# EAGLE design e202var-receiver-v1 (EAGLE 6.6.0)
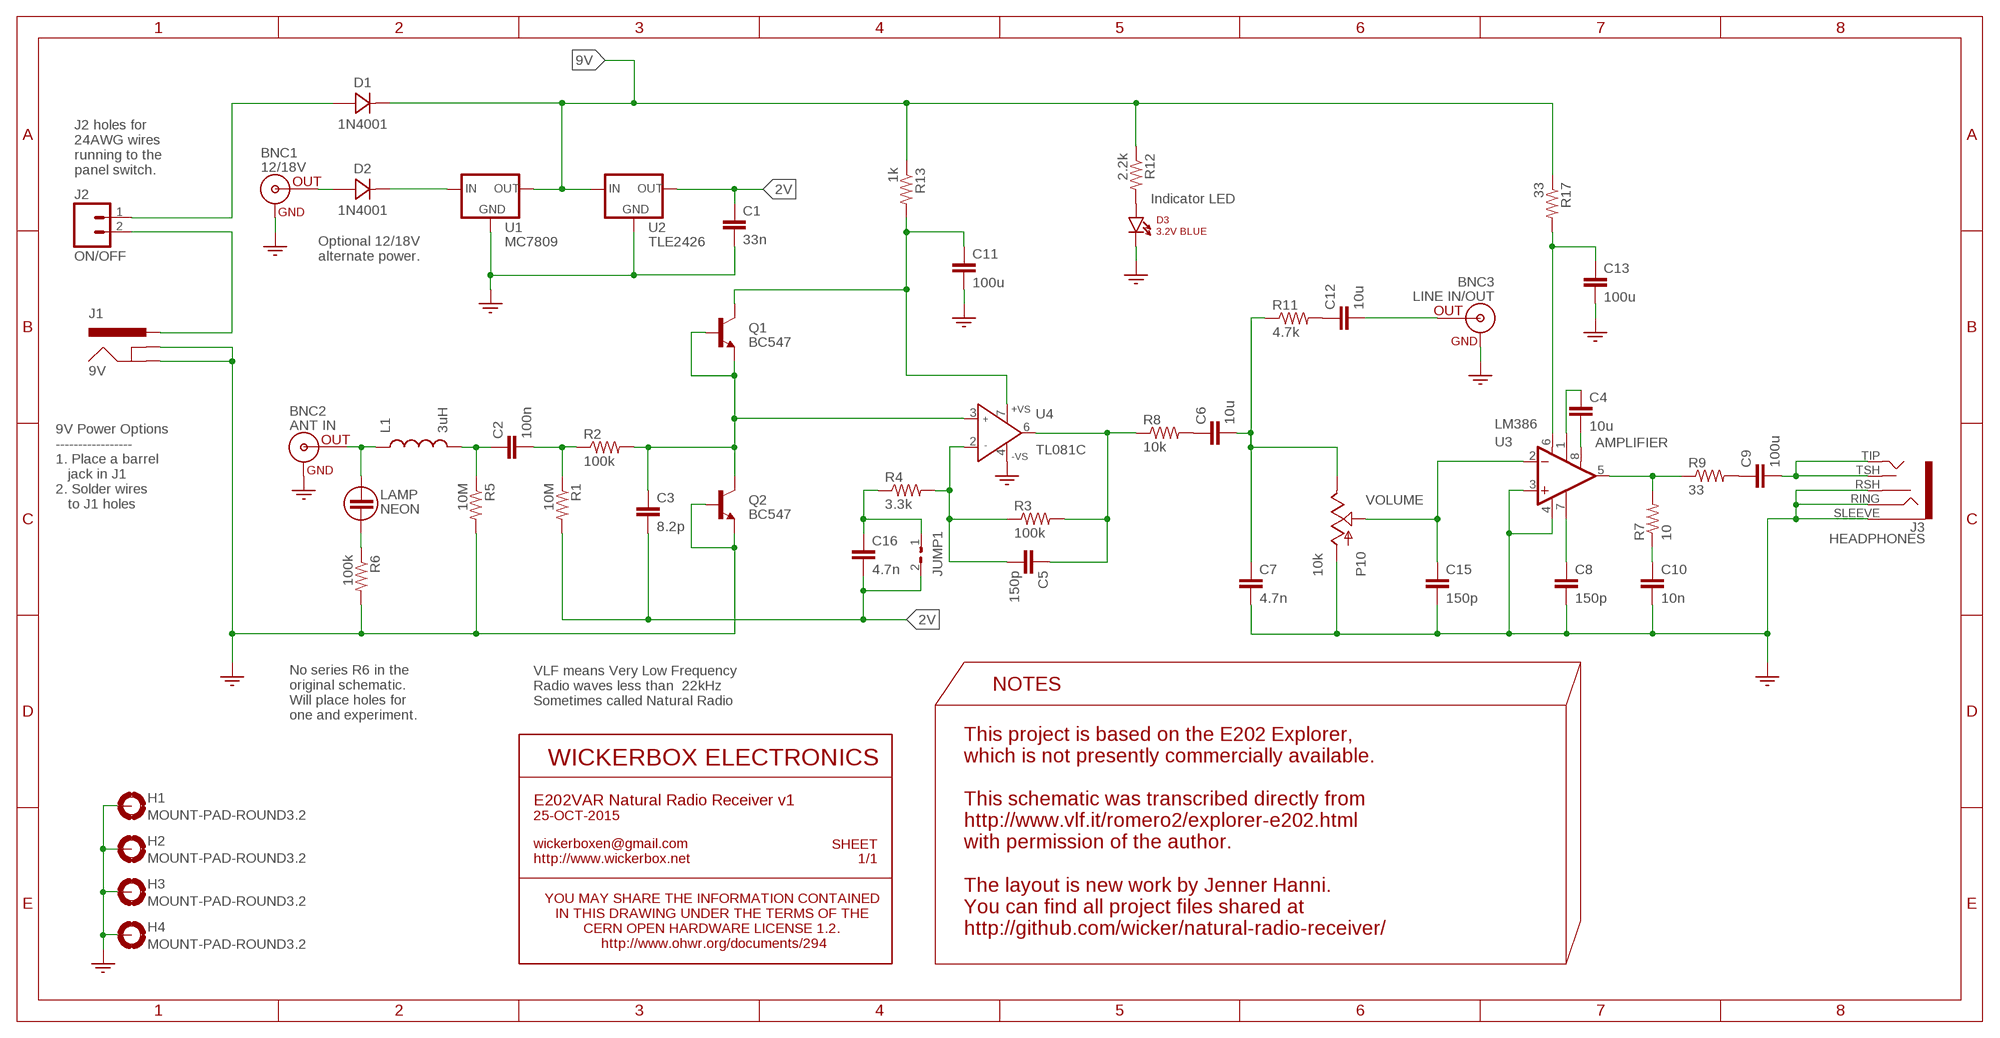
[diagram p0: schematic, sheet 1]

## Parts
BNC1  12/18V  BNC-MOLEX-SD-73100  [BNC-MOLEX-SD-73100]
BNC2  ANT IN  BNC-MOLEX-SD-73100  [BNC-MOLEX-SD-73100]
BNC3  LINE IN/OUT  BNC-MOLEX-SD-73100  [BNC-MOLEX-SD-73100]
C1  33n  CAPACITOR5MM  [CAP-RADIAL-5MM-NONPOL]
C2  100n  CAPACITOR5MM  [CAP-RADIAL-5MM-NONPOL]
C3  8.2p  CAPACITOR5MM  [CAP-RADIAL-5MM-NONPOL]
C4  10u  CAPACITOR2.5MM  [CAP-RADIAL-2.5MM-NONPOL]
C5  150p  CAPACITOR2.5MM  [CAP-RADIAL-2.5MM-NONPOL]
C6  10u  CAPACITOR2.5MM  [CAP-RADIAL-2.5MM-NONPOL]
C7  4.7n  CAPACITOR5MM  [CAP-RADIAL-5MM-NONPOL]
C8  150p  CAPACITOR2.5MM  [CAP-RADIAL-2.5MM-NONPOL]
C9  100u  CAPACITOR5MM  [CAP-RADIAL-5MM-NONPOL]
C10  10n  CAPACITOR2.5MM  [CAP-RADIAL-2.5MM-NONPOL]
C11  100u  CAPACITOR5MM  [CAP-RADIAL-5MM-NONPOL]
C12  10u  CAPACITOR2.5MM  [CAP-RADIAL-2.5MM-NONPOL]
C13  100u  CAPACITOR5MM  [CAP-RADIAL-5MM-NONPOL]
C15  150p  CAPACITOR2.5MM  [CAP-RADIAL-2.5MM-NONPOL]
C16  4.7n  CAPACITOR5MM  [CAP-RADIAL-5MM-NONPOL]
D1  1N4001  DIODE  [DIODE-DO41]
D2  1N4001  DIODE  [DIODE-DO41]
D3  3.2V BLUE  LED  [LED-2PIN-0.1IN]
H1  MOUNT-PAD-ROUND3.2  [3,2-PAD]
H2  MOUNT-PAD-ROUND3.2  [3,2-PAD]
H3  MOUNT-PAD-ROUND3.2  [3,2-PAD]
H4  MOUNT-PAD-ROUND3.2  [3,2-PAD]
J1  9V  JACK-POWER-BARREL  [JACK-POWER]
J2  ON/OFF  CONN-2PIN  [CONN-2PIN-0.1IN]
J3  HEADPHONES  JACK-AUDIO  [JACK-AUDIO-5PIN]
JUMP1  HPF  JUMPER-SHUNT  [CONN-2PIN-0.1IN]
L1  3uH  INDUCTOR  [RES-CF14-TH]
LAMP  NEON  LAMP-NEON  [LAMP-2PIN-0.1IN]
P10  10k  POT-P160KN-0QC15B10K  [POT-3PIN-LINEAR]
Q1  BC547  BJT-NPN  [TO-92-AMMO]
Q2  BC547  BJT-NPN  [TO-92-AMMO]
R1  10M  RESISTOR  [RES-CF14-TH]
R2  100k  RESISTOR  [RES-CF14-TH]
R3  100k  RESISTOR  [RES-CF14-TH]
R4  3.3k  RESISTOR  [RES-CF14-TH]
R5  10M  RESISTOR  [RES-CF14-TH]
R6  100k  RESISTOR  [RES-CF14-TH]
R7  10  RESISTOR  [RES-CF14-TH]
R8  10k  RESISTOR  [RES-CF14-TH]
R9  33  RESISTOR  [RES-CF14-TH]
R11  4.7k  RESISTOR  [RES-CF14-TH]
R12  2.2k  RESISTOR  [RES-CF14-TH]
R13  1k  RESISTOR  [RES-CF14-TH]
R17  33  RESISTOR  [RES-CF14-TH]
U1  MC7809  VOLTREG-MC7809  [TO-220]
U2  TLE2426  VOLTREG-TLE2426  [DIP-08]
U3  LM386  AMP-AUDIO-LM386  [DIP-08]
U4  TL081C  AMP-JFET-TL081CP  [DIP-08]

## Nets
2V: C1.1 C3.2 C16.2 JUMP1.2 R1.P$2 U2.1(OUT)
9V: D1.C(CATHODE) R12.P$1 R13.P$1 R17.P$1 U1.OUT U2.3(IN)
9V1: J1.PWR J2.2
9V2: D1.A(ANODE) J2.1
GND: BNC1.GND BNC1.GND1(GND) BNC2.GND BNC2.GND1(GND) BNC3.GND BNC3.GND1(GND) C1.2 C7.2 C8.2 C10.2 C11.2 C13.2 C15.2 D3.C(CATHODE) H1.B3,2(MOUNT) H2.B3,2(MOUNT) H3.B3,2(MOUNT) H4.B3,2(MOUNT) J1.GND J1.GNDBREAK J3.RING J3.RSH J3.SLEEVE P10.1(A) Q2.2(B) Q2.3(E) R5.P$2 R6.P$2 U1.GND U2.2(GND) U3.3(+IN) U3.4(V-) U4.4(-VS) ; supply symbol labelled SYM-GND
N$6: C11.1 Q1.1(C) R13.P$2 U4.7(+VS)
N$7: BNC2.SIGNAL(OUT) L1.P$1 LAMP.A
N$8: C5.2 R3.P$1 R4.P$2 U4.2(IN-)
N$9: C2.1 L1.P$2 R5.P$1
N$10: C2.2 R1.P$1 R2.P$1
N$11: C16.1 JUMP1.1 R4.P$1
N$12: C6.1 R8.P$2
N$13: C5.1 R3.P$2 R8.P$1 U4.6(OUT)
N$14: C6.2 C7.1 P10.3(E) R11.P$1
N$15: C12.1 R11.P$2
N$16: C4.1 U3.1(GAIN)
N$17: BNC3.SIGNAL(OUT) C12.2
N$18: C4.2 U3.8(GAIN)
N$19: C13.1 R17.P$2 U3.6(V+)
N$20: C8.1 U3.7(BP)
N$21: C15.1 P10.2(S) U3.2(-IN)
N$22: D3.A(ANODE) R12.P$2
N$23: R7.P$2 R9.P$1 U3.5(OUT)
N$24: C9.1 R9.P$2
N$25: C9.2 J3.TIP J3.TSH
N$26: C10.1 R7.P$1
N$27: LAMP.C R6.P$1
Q1OUT: C3.1 Q1.2(B) Q1.3(E) Q2.1(C) R2.P$2 U4.3(IN+)
VIN: BNC1.SIGNAL(OUT) D2.A(ANODE)
VIN2: D2.C(CATHODE) U1.IN

## Notes on the sheet
- J2 holes for
  24AWG wires
  running to the
  panel switch.
- Indicator LED
- Optional 12/18V 
  alternate power.
- AMPLIFIER
- VOLUME
- 9V Power Options
  -----------------
  1. Place a barrel 
     jack in J1 
  2. Solder wires
     to J1 holes
- NOTES
- VLF means Very Low Frequency
  Radio waves less than  22kHz
  Sometimes called Natural Radio
- No series R6 in the
  original schematic.
  Will place holes for
  one and experiment.
- This project is based on the E202 Explorer,
  which is not presently commercially available.
  
  This schematic was transcribed directly from
  http://www.vlf.it/romero2/explorer-e202.html 
  with permission of the author.
  
  The layout is new work by Jenner Hanni. 
  You can find all project files shared at 
  http://github.com/wicker/natural-radio-receiver/

## Library data of the parts
BNC1-BNC3 = e202var-receiver:BNC-MOLEX-SD-73100
C1-C13 C15 C16 = e202var-receiver:CAPACITOR
D1 D2 = e202var-receiver:DIODE
D3 = e202var-receiver:LED
H1-H4 = holes:MOUNT-PAD-ROUND: MOUNTING PAD, round
J1 = e202var-receiver:JACK-POWER-BARREL
J2 = e202var-receiver:CONN-2PIN
J3 = e202var-receiver:JACK-AUDIO: I suspect the 5pin package works for the 3pin part.
JUMP1 = e202var-receiver:JUMPER-SHUNT
L1 = e202var-receiver:INDUCTOR
LAMP = e202var-receiver:LAMP-NEON
P10 = e202var-receiver:POT-P160KN-0QC15B10K
Q1 Q2 = e202var-receiver:BJT-NPN
R1-R9 R11-R13 R17 = e202var-receiver:RESISTOR
U1 = e202var-receiver:VOLTREG-MC7809
U2 = e202var-receiver:VOLTREG-TLE2426
U3 = e202var-receiver:AMP-AUDIO-LM386
U4 = e202var-receiver:AMP-JFET-TL081CP

## Board
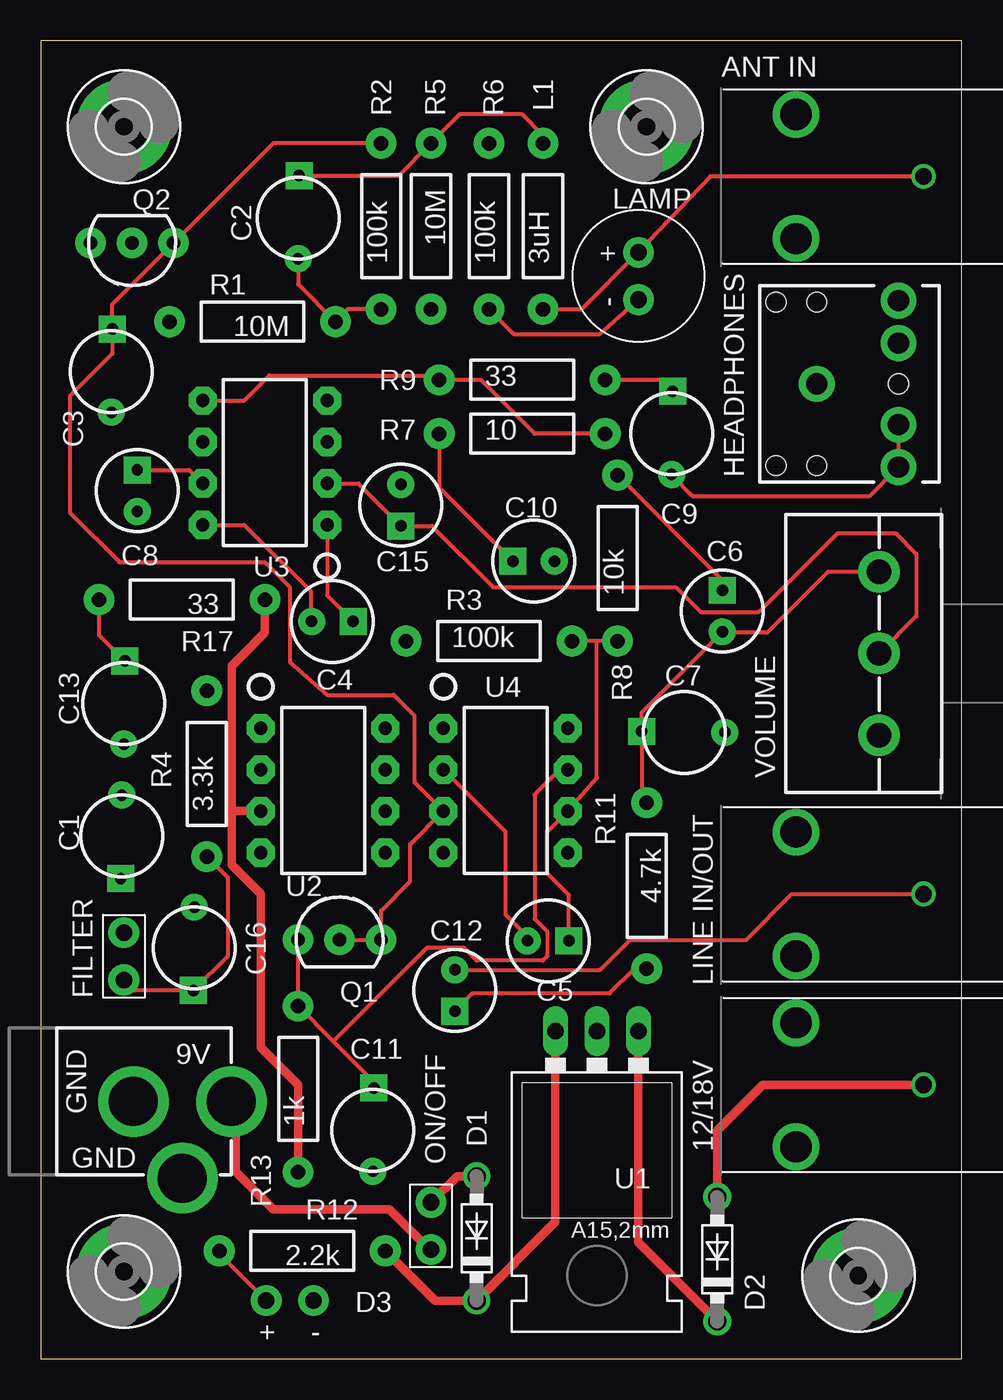
[diagram p1: board, top side]
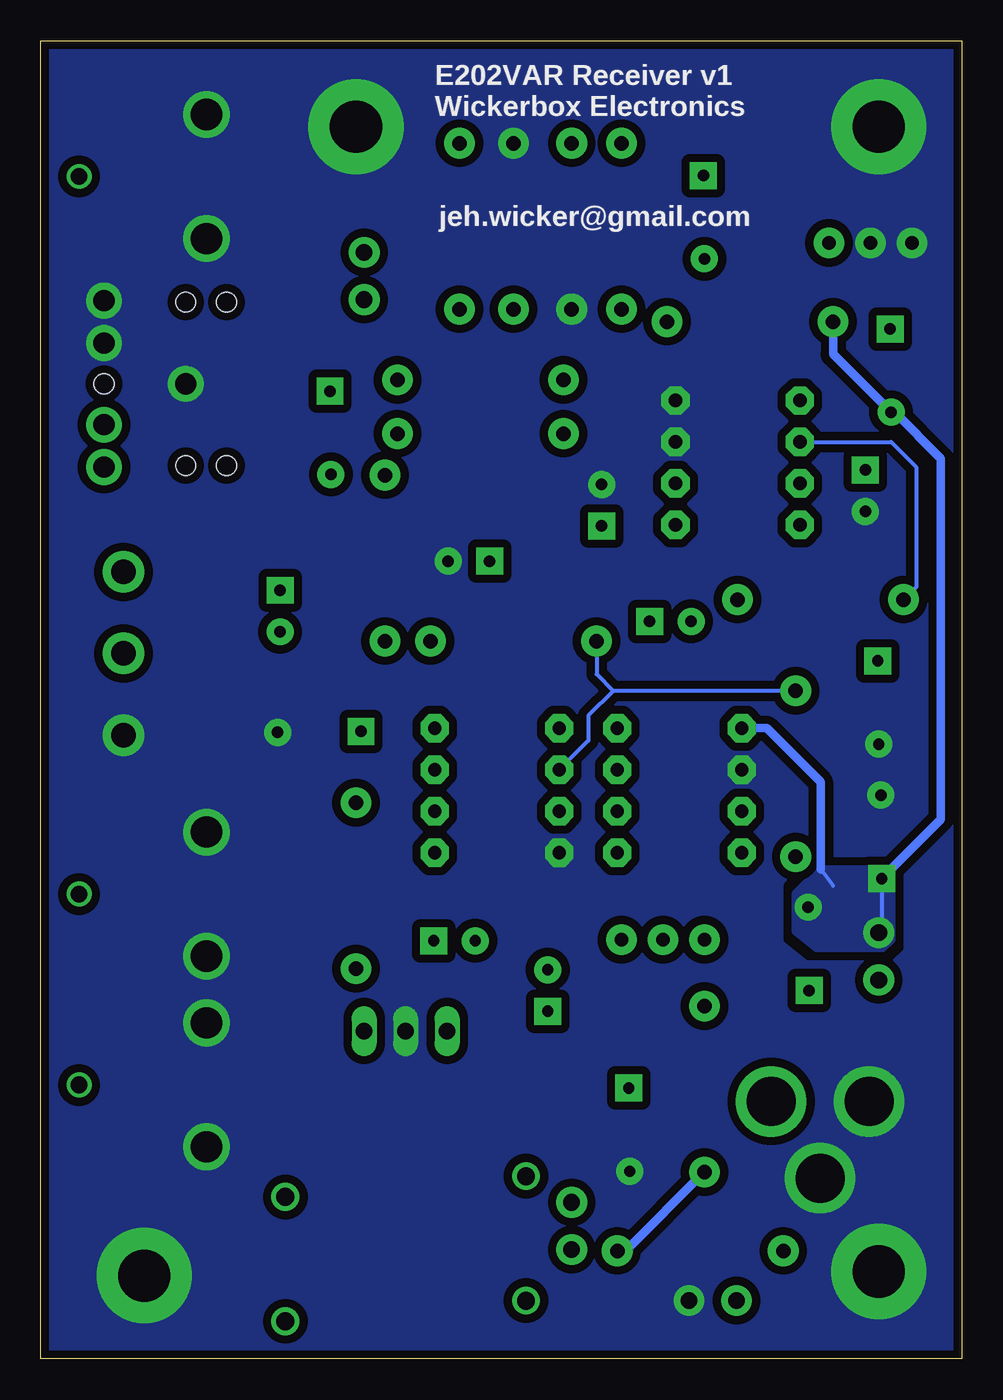
[diagram p2: board, bottom side, seen from below]

Size 56.37 x 80.7 mm. Coordinates in mm from the lower left corner, seen from the top.
Outline: 0,0 56.37,0 56.37,80.7 0,80.7 0,0
Copper layers (1*16): Top 0.0356mm / dielectric 1.5011mm / Bottom 0.0356mm
Design rules "oshpark-2layer": minimum track width 6mil, minimum drill 13mil, track to track 6mil, track to pad 6mil, pad to pad 6mil, via to via 6mil, smd to smd 6mil, copper to edge 15mil, drill to drill 6mil, minimum pad ring 7mil, minimum via ring 7mil, stop-mask expansion 4mil, vias tented up to drill 0mil, thermal gap 10mil

### Footprints (pad centres in the part's own frame; a part is rotated, then mirrored left to right if it is on the bottom)
BNC-MOLEX-SD-73100 = drill 1.905: GND -3.797,0; GND1 3.797,0 | drill 1.016: SIGNAL 0,7.798
CAP-RADIAL-5MM-NONPOL = drill 0.7 pad 1.651 square: 1 2.6,-0.06 | drill 0.7 pad 1.651: 2 -2.5,0
CAP-RADIAL-2.5MM-NONPOL = drill 0.7 pad 1.651 square: 1 1.33,-0.06 | drill 0.7 pad 1.651: 2 -1.21,-0.06
DIODE-DO41 = drill 1.1 pad 1.7: A 3.81,0; C -3.81,0
LED-2PIN-0.1IN = drill 1.016 pad 1.88: A -1.448,0; C 1.448,0
3,2-PAD = drill 3.2 pad 5.842: B3,2 0,0
JACK-POWER = drill 2.997 pad 4.318: GND 0,0.08; GNDBREAK 4.7,3.08; PWR 0,6.08
CONN-2PIN-0.1IN = drill 1.016 pad 1.88: 1 -1.448,0; 2 1.448,0
JACK-AUDIO-5PIN = drill 1.3 pad 2.184: RING 5,5.1; RSH 5,2.5; SLEEVE 0,0; TIP 5,-5.1; TSH 5,-2.5 | hole 1.2: 0,5; -2.5,5; -2.5,-5; 0,-5; 5,0
RES-CF14-TH = drill 0.889 pad 1.88: P$1 -4.826,-0.254; P$2 5.334,-0.254
LAMP-2PIN-0.1IN = drill 1.016 pad 1.88: A -1.448,0; C 1.448,0
POT-3PIN-LINEAR = drill 1.5 pad 2.54: 1 -5,0; 2 0,0; 3 5,0
TO-92-AMMO = drill 0.813 pad 1.88: 1 -2.54,0; 2 0,0; 3 2.54,0
TO-220 = drill 1.016 long: GND 0,0; IN -2.54,0; OUT 2.54,0
DIP-08 = drill 0.813 pad 1.727 octagon: 1 -3.81,-3.81; 2 -1.27,-3.81; 3 1.27,-3.81; 4 3.81,-3.81; 5 3.81,3.81; 6 1.27,3.81; 7 -1.27,3.81; 8 -3.81,3.81

### Placement (x,y rotation side)
BNC1  46.23,16.76 270 top
BNC2  46.23,72.39 270 top
BNC3  46.23,28.45 270 top
C1  4.95,32 270 top
C2  15.75,69.85 90 top
C3  4.32,60.45 90 top
C4  17.78,45.21 0 top
C5  30.99,25.65 0 top
C6  41.66,45.72 90 top
C7  39.37,38.35 180 top
C8  5.84,53.09 90 top
C9  38.61,56.64 90 top
C10  30.23,48.77 180 top
C11  20.32,13.97 90 top
C12  25.4,22.61 270 top
C13  5.08,40.13 90 top
C15  22.1,52.32 270 top
C16  9.4,25.15 270 top
D1  26.67,7.37 90 top
D2  41.4,6.1 90 top
D3  15.24,3.56 0 top
H1  5.08,5.33 0 top
H2  50.04,5.08 0 top
H3  5.08,75.44 0 top
H4  37.08,75.44 0 top
J1  5.59,15.75 270 top
J2  23.88,8.13 270 top
J3  47.5,59.69 0 top
JUMP1  5.08,24.64 90 top
L1  30.48,69.09 90 top
LAMP  36.58,66.29 270 top
P10  51.31,43.18 90 top
Q1  18.29,25.65 0 top
Q2  5.59,68.33 180 top
R1  13.21,63.25 180 top
R2  20.57,69.09 90 top
R3  27.18,44.2 0 top
R4  9.91,35.56 90 top
R5  24.13,69.6 270 top
R6  27.18,69.09 90 top
R7  29.21,56.9 0 top
R8  35.05,48.77 90 top
R9  29.21,60.2 0 top
R11  37.34,29.21 270 top
R12  16.26,6.35 180 top
R13  15.49,16.26 90 top
R17  8.89,46.23 180 top
U1  34.04,20.07 180 top
U2  17.27,34.8 270 top
U3  13.72,54.86 90 top
U4  28.45,34.8 270 top

### Tracks (layer width: path | path; a pad name or v marks a point on that pad's centre or on a via)
2V
  Bottom 0.254: C3.2 4.1,57.95 | C1.1 4.89,26.27 JUMP1.2 | 8.64,29.97 7.87,28.96
  Bottom 0.508: 4.1,57.95 1.27,55.12 1.27,33.03 C1.1 | U2.1 11.94,38.61 8.64,35.31 8.64,29.97 | R1.P$2 7.87,61.51 C3.2
  pour Bottom (isolate 0.508, no thermals): 10.16,28.45 10.16,26.16 8.89,25.15 4.83,25.15 4.32,25.65 4.32,29.97 8.64,29.97
9V
  Top 0.508: R12.P$1 24.13,3.56 D1.C 31.5,8.38 U1.OUT | R13.P$1 15.75,16.76 13.46,19.05 13.46,28.45 11.68,30.23 11.68,33.53 | R17.P$1 13.72,44.45 12.32,43.05 11.94,42.67 11.68,42.42 11.68,33.53 | U2.3 11.68,33.53
  Bottom 0.508: R12.P$1 20.57,6.6 R13.P$1
9V1
  Top 0.508: J2.2 23.8,6.68 21.34,9.14 14.22,9.14 11.94,11.43 11.94,15.48 J1.PWR
9V2
  Top 0.508: D1.A 25.48,11.18 J2.1
GND
  pour Bottom (isolate 0.508, rank 5, no thermals): -0.25,80.52 56.13,80.52 56.39,0 0,0
N$6
  Top 0.254: Q1.1 R13.P$2 17.91,19.43 | C11.1 20.38,16.96 17.91,19.43 | U4.7 31.75,36.07 30.23,34.54 30.23,26.92 30.99,26.16 30.99,24.64 30.73,24.38 26.67,24.38 25.91,25.15 23.62,25.15 17.91,19.43
N$7
  Top 0.254: BNC2.SIGNAL 40.97,72.39 LAMP.A 33.1,64.26 L1.P$1
N$8
  Top 0.254: C5.2 29.78,25.85 28.45,27.18 28.45,32.26 U4.2
  Bottom 0.254: R4.P$2 21.34,40.89 | 21.34,40.89 22.86,39.37 22.86,37.85 U4.2 | R3.P$1 22.35,41.91 21.34,40.89
N$9
  Top 0.254: L1.P$2 30.73,74.93 29.46,76.2 25.65,76.2 R5.P$1 21.9,72.45 C2.1
N$10
  Top 0.254: R2.P$1 18.8,64.26 R1.P$1 15.75,65.79 C2.2
N$11
  Top 0.254: R4.P$1 11.43,29.46 11.43,24.64 C16.1 5.72,22.55 JUMP1.1
N$12
  Top 0.254: C6.1 41.72,47.69 R8.P$2
N$13
  Top 0.254: C5.1 32.32,28.39 30.99,29.72 30.99,32.26 U4.6 34.04,35.56 34.04,43.94 | R8.P$1 34.04,43.94 | 34.04,43.94 R3.P$2
N$14
  Top 0.254: R11.P$1 36.77,34.35 C7.1 36.77,39.56 C6.2 41.78,44.45 44.45,44.45 48.18,48.18 P10.3
N$15
  Top 0.254: R11.P$2 36.32,23.88 34.8,22.35 26.42,22.35 C12.1
N$16
  Top 0.254: U3.1 17.53,46.74 C4.1
N$17
  Top 0.254: C12.2 34.23,23.82 36.07,25.65 43.18,25.65 45.97,28.45 BNC3.SIGNAL
N$18
  Top 0.254: U3.8 12.45,51.05 16.51,46.99 16.51,45.21 C4.2
N$19
  Top 0.254: R17.P$2 3.56,44.32 C13.1
  Bottom 0.254: U3.6 4.32,56.13 2.79,54.61 2.79,47.24 R17.P$2
N$20
  Top 0.254: C8.1 9.08,54.42 U3.7
N$21
  Top 0.254: U3.2 19.44,53.59 C15.1 23.94,50.99 27.69,47.24 38.86,47.24 40.39,45.72 43.94,45.72 48.77,50.55 52.32,50.55 53.59,49.28 53.59,45.47 P10.2
N$22
  Top 0.254: R12.P$2 10.92,6.43 D3.A
N$23
  Top 0.254: R7.P$2 30.23,56.64 26.92,59.94 R9.P$1 24.13,60.2 13.97,60.2 12.45,58.67 U3.5
N$24
  Top 0.254: R9.P$2 37.97,59.94 C9.1
N$25
  Top 0.254: C9.2 38.61,54.1 39.88,52.83 50.74,52.83 J3.TIP J3.TSH
N$26
  Top 0.254: R7.P$1 24.38,53.34 C10.1
N$27
  Top 0.254: R6.P$1 28.96,62.74 34.21,62.74 LAMP.C
Q1OUT
  Top 0.254: R2.P$2 14.22,74.42 Q2.1 4.38,64.58 C3.1 4.38,61.53 1.78,58.93 1.78,51.82 4.83,48.77 13.72,48.77 15.24,47.24 15.24,42.67 17.53,40.64 21.59,40.64 22.86,39.37 22.86,35.31 U4.3 22.61,31.5 22.61,29.21 20.83,27.43 Q1.3 Q1.2
VIN
  Top 0.508: BNC1.SIGNAL 44.2,16.76 41.4,13.97 D2.A
VIN2
  Top 0.508: U1.IN 36.58,7.11 D2.C

### Text on the board
tPlace: ANT IN | HEADPHONES | VOLUME | FILTER | LINE IN/OUT | 9V | ON/OFF | GND | GND | 12/18V
bPlace: E202VAR Receiver v1 / Wickerbox Electronics | jeh.wicker@gmail.com